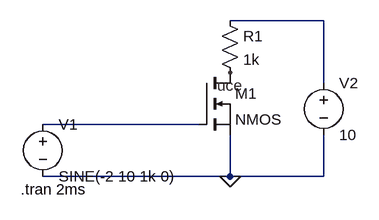
[diagram p0: schematic Draft1.asc]
Draft1.asc, the LTspice schematic file:
Version 4
SHEET 1 880 680
WIRE 480 32 336 32
WIRE 480 128 480 32
WIRE 288 192 48 192
WIRE 336 272 336 208
WIRE 336 272 48 272
WIRE 480 272 480 208
WIRE 480 272 336 272
FLAG 336 272 0
FLAG 336 112 uce
SYMBOL voltage 48 176 R0
WINDOW 123 0 0 Left 0
WINDOW 39 0 0 Left 0
SYMATTR InstName V1
SYMATTR Value SINE(-2 10 1k 0)
SYMBOL nmos 288 112 R0
SYMATTR InstName M1
SYMBOL res 320 16 R0
SYMATTR InstName R1
SYMATTR Value 1k
SYMBOL voltage 480 112 R0
WINDOW 123 0 0 Left 0
WINDOW 39 0 0 Left 0
SYMATTR InstName V2
SYMATTR Value 10
TEXT 14 292 Left 2 !.tran 2ms

The netlist it stands for:
* Draft1.asc
V1 N002 0 SINE(-2 10 1k 0)
M1 uce N002 0 0 NMOS
R1 N001 uce 1k
V2 N001 0 10
.model NMOS NMOS
.model PMOS PMOS
.lib standard.mos
.tran 2ms
.backanno
.end